# EAGLE design ESClogic (EAGLE 5.11)
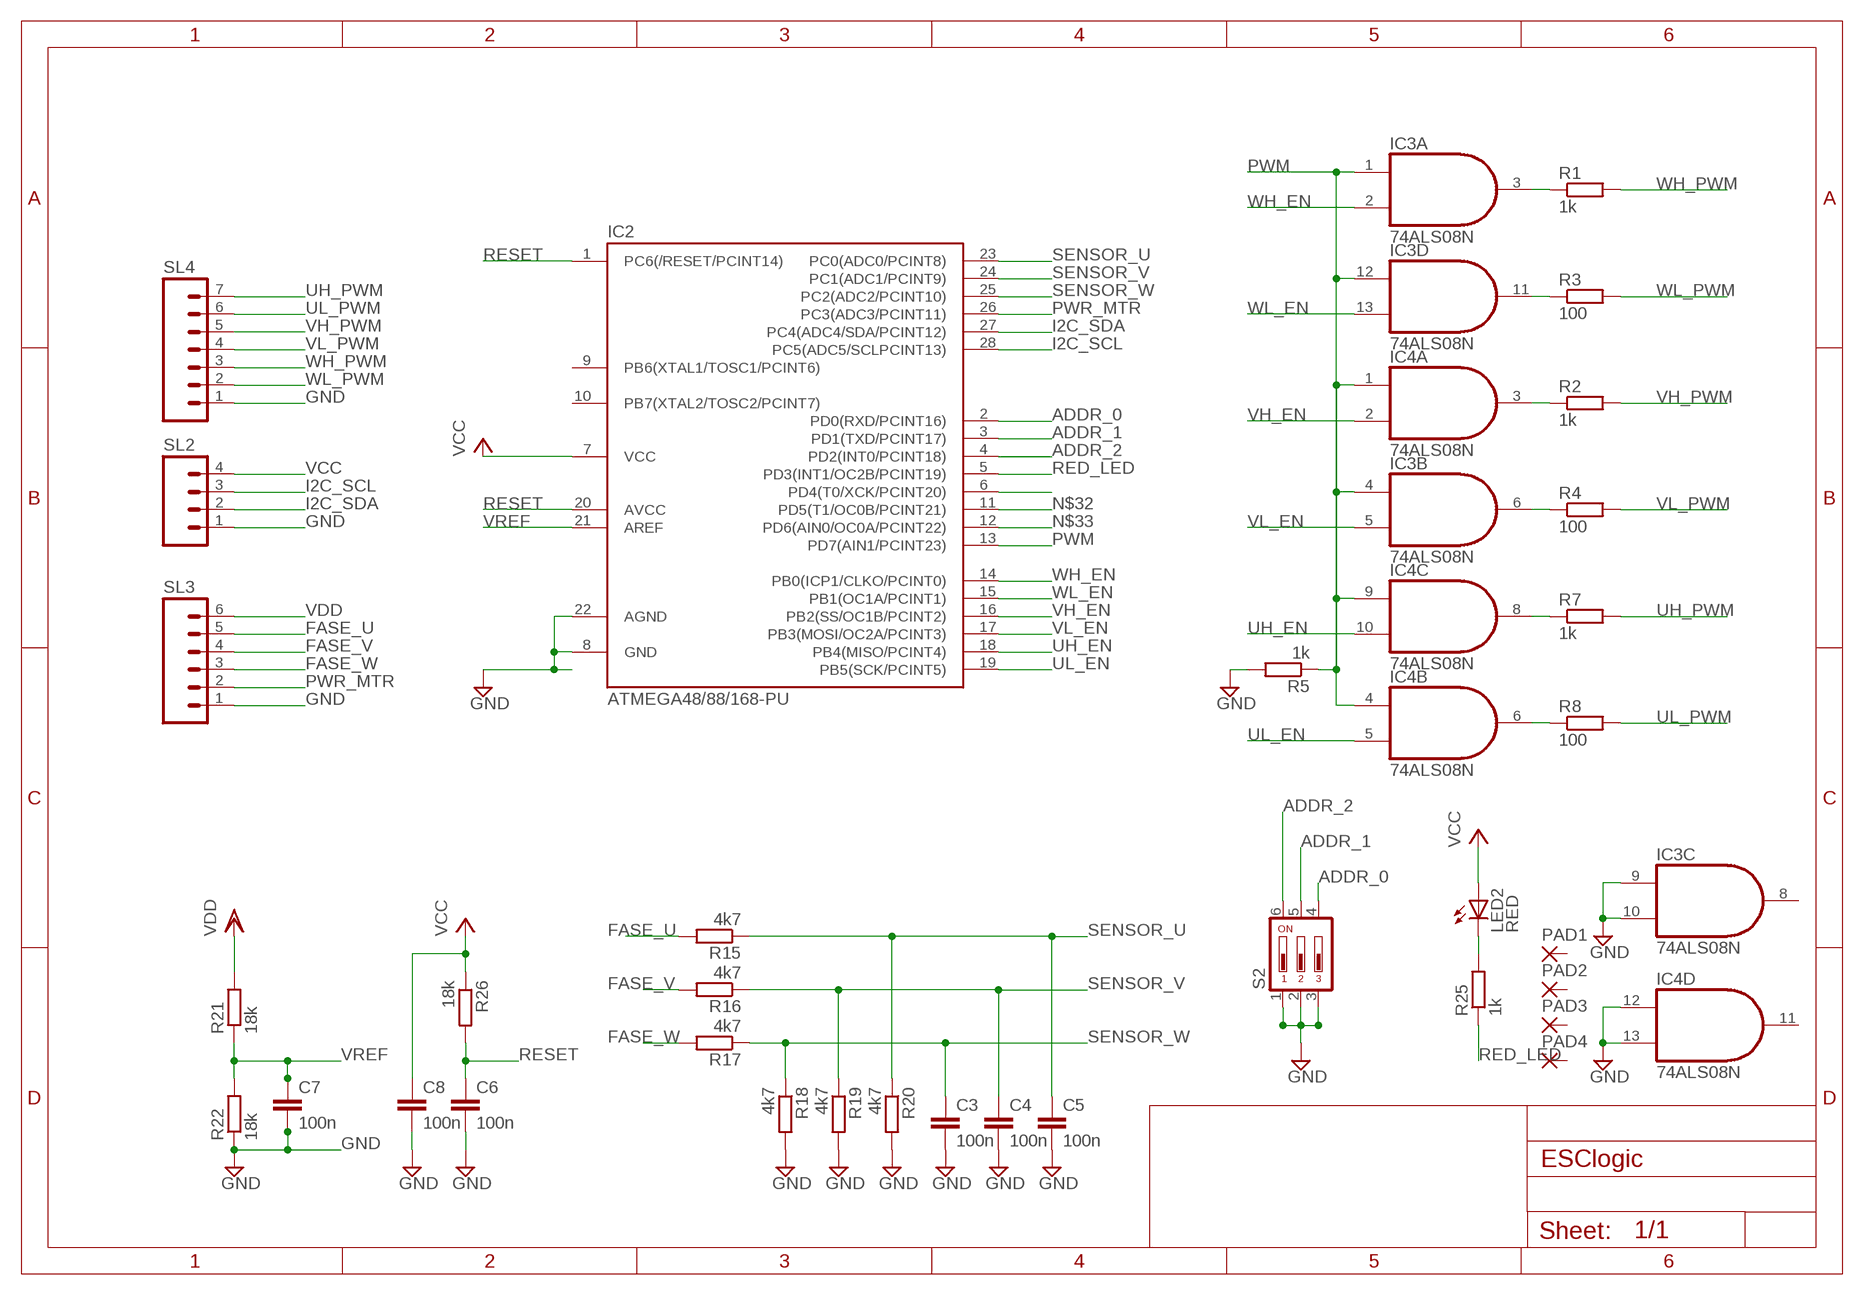
[diagram p0: schematic, sheet 1]

## Parts
C3  100n  C-EUC0805  [C0805]
C4  100n  C-EUC0805  [C0805]
C5  100n  C-EUC0805  [C0805]
C6  100n  C-EUC0805  [C0805]
C7  100n  C-EUC0805  [C0805]
C8  100n  C-EUC0805  [C0805]
IC2  ATMEGA48/88/168-PU  [DIL28-3]
IC3  74ALS08N  [DIL14]
IC4  74ALS08N  [DIL14]
LED2  RED  LEDLSU260  [LSU260]
PAD1  2,54/1,0  [2,54/1,0]
PAD2  2,54/1,0  [2,54/1,0]
PAD3  2,54/1,0  [2,54/1,0]
PAD4  2,54/1,0  [2,54/1,0]
R1  1k  R-EU_R0805  [R0805]
R2  1k  R-EU_M0805  [M0805]
R3  100  R-EU_M0805  [M0805]
R4  100  R-EU_M0805  [M0805]
R5  1k  R-EU_M0805  [M0805]
R7  1k  R-EU_M0805  [M0805]
R8  100  R-EU_M0805  [M0805]
R15  4k7  R-EU_M0805  [M0805]
R16  4k7  R-EU_M0805  [M0805]
R17  4k7  R-EU_M0805  [M0805]
R18  4k7  R-EU_M0805  [M0805]
R19  4k7  R-EU_M0805  [M0805]
R20  4k7  R-EU_M0805  [M0805]
R21  18k  R-EU_M0805  [M0805]
R22  18k  R-EU_M0805  [M0805]
R25  1k  R-EU_R0805  [R0805]
R26  18k  R-EU_M0805  [M0805]
S2  DIP03YL  [DIP03YL]
SL2  M04  [04P]
SL3  M06  [06P]
SL4  M07  [07P]

## Nets
ADDR_0: IC2.2(PD0(RXD/PCINT16)) S2.4
ADDR_1: IC2.3(PD1(TXD/PCINT17)) S2.5
ADDR_2: IC2.4(PD2(INT0/PCINT18)) S2.6
FASE_U: R15.2 SL3.5
FASE_V: R16.2 SL3.4
FASE_W: R17.2 SL3.3
GND: C3.2 C4.2 C5.2 C6.2 C7.2 C8.2 IC2.8(GND) IC2.22(AGND) IC3.9(C:I0) IC3.10(C:I1) IC4.12(D:I0) IC4.13(D:I1) R5.2 R18.2 R19.2 R20.2 R22.1 S2.1 S2.2 S2.3 SL2.1 SL3.1 SL4.1
I2C_SCL: IC2.28(PC5(ADC5/SCLPCINT13)) SL2.3
I2C_SDA: IC2.27(PC4(ADC4/SDA/PCINT12)) SL2.2
N$8: LED2.K(C) R25.2
N$12: IC3.3(A:O) R1.1
N$14: IC3.11(D:O) R3.1
N$15: IC4.3(A:O) R2.1
N$16: IC3.6(B:O) R4.1
N$17: IC4.8(C:O) R7.1
N$18: IC4.6(B:O) R8.1
N$31: IC2.6(PD4(T0/XCK/PCINT20))
N$32: IC2.11(PD5(T1/OC0B/PCINT21))
N$33: IC2.12(PD6(AIN0/OC0A/PCINT22))
PWM: IC2.13(PD7(AIN1/PCINT23)) IC3.1(A:I0) IC3.4(B:I0) IC3.12(D:I0) IC4.1(A:I0) IC4.4(B:I0) IC4.9(C:I0) R5.1
PWR_MTR: IC2.26(PC3(ADC3/PCINT11)) SL3.2
RED_LED: IC2.5(PD3(INT1/OC2B/PCINT19)) R25.1
RESET: C6.1 IC2.1(PC6(/RESET/PCINT14)) IC2.20(AVCC) R26.2
SENSOR_U: C5.1 IC2.23(PC0(ADC0/PCINT8)) R15.1 R20.1
SENSOR_V: C4.1 IC2.24(PC1(ADC1/PCINT9)) R16.1 R19.1
SENSOR_W: C3.1 IC2.25(PC2(ADC2/PCINT10)) R17.1 R18.1
UH_EN: IC2.18(PB4(MISO/PCINT4)) IC4.10(C:I1)
UH_PWM: R7.2 SL4.7
UL_EN: IC2.19(PB5(SCK/PCINT5)) IC4.5(B:I1)
UL_PWM: R8.2 SL4.6
VCC: C8.1 IC2.7(VCC) LED2.A R26.1 SL2.4
VDD: R21.2 SL3.6
VH_EN: IC2.16(PB2(SS/OC1B/PCINT2)) IC4.2(A:I1)
VH_PWM: R2.2 SL4.5
VL_EN: IC2.17(PB3(MOSI/OC2A/PCINT3)) IC3.5(B:I1)
VL_PWM: R4.2 SL4.4
VREF: C7.1 IC2.21(AREF) R21.1 R22.2
WH_EN: IC2.14(PB0(ICP1/CLKO/PCINT0)) IC3.2(A:I1)
WH_PWM: R1.2 SL4.3
WL_EN: IC2.15(PB1(OC1A/PCINT1)) IC3.13(D:I1)
WL_PWM: R3.2 SL4.2
Unconnected: IC2.9(PB6(XTAL1/TOSC1/PCINT6)) IC2.10(PB7(XTAL2/TOSC2/PCINT7)) IC3.8(C:O) IC4.11(D:O) PAD1.1(P) PAD2.1(P) PAD3.1(P) PAD4.1(P)

## Power pins joined to a net without a drawn wire
GND: IC3.7(P:GND) IC4.7(P:GND)
VCC: IC3.14(P:VCC) IC4.14(P:VCC)

## Library data of the parts
C3-C8 = rcl:C-EU: CAPACITOR, European symbol
IC2 = atmega8:ATMEGA48/88/168-PU
IC3 IC4 = 74xx-us:74*08: Quad 2-input AND gate
LED2 = led:LED: LED OSRAM: - CHIPLED LG R971, LG N971, LY N971, LG Q971, LY Q971, LO R971, LY R971 LH N974, LH R974 LS Q976, LO Q976, LY Q976 LO Q996 - Hyper CHIPLED LW Q18S LB Q993, LB Q99A, LB R99A - SideLED LS A670, LO A670, LY A670, LG A670, LP A670 LB A673, LV A673, LT A673, LW A673 LH A674 LY A675 LS A676, LA A676, LO A676, LY A676, LW A676 LS A679, LY A679, LG A679 - Hyper Micro SIDELED® LS Y876, LA Y876, LO Y876, LY Y876 LT Y87S - SmartLED LW L88C, LW L88S LB L89C, LB L89S, LG L890 LS L89K, LO L89K, LY L89K LS L896, LA L896, LO L896, LY L896 - TOPLED LS T670, LO T670, LY T670, LG T670, LP T670 LSG T670, LSP T670, LSY T670, LOP T670, LYG T670 LG T671, LOG T671, LSG T671 LB T673, LV T673, LT T673, LW T673 LH T674 LS T676, LA T676, LO T676, LY T676, LB T676, LH T676, LSB T676, LW T676 LB T67C, LV T67C, LT T67C, LS T67K, LO T67K, LY T67K, LW E67C LS E67B, LA E67B, LO E67B, LY E67B, LB E67C, LV E67C, LT E67C LW T67C LS T679, LY T679, LG T679 LS T770, LO T770, LY T770, LG T770, LP T770 LB T773, LV T773, LT T773, LW T773 LH T774 LS E675, LA E675, LY E675, LS T675 LS T776, LA T776, LO T776, LY T776, LB T776 LHGB T686 LT T68C, LB T68C - Hyper Mini TOPLED® LB M676 - Mini TOPLED Santana® LG M470 LS M47K, LO M47K, LY M47K Source: http://www.osram.convergy.de LUXEON: - LUMILED® LXK2-PW12-R00, LXK2-PW12-S00, LXK2-PW14-U00, LXK2-PW14-V00 LXK2-PM12-R00, LXK2-PM12-S00, LXK2-PM14-U00 LXK2-PE12-Q00, LXK2-PE12-R00, LXK2-PE12-S00, LXK2-PE14-T00, LXK2-PE14-U00 LXK2-PB12-K00, LXK2-PB12-L00, LXK2-PB12-M00, LXK2-PB14-N00, LXK2-PB14-P00, LXK2-PB14-Q00 LXK2-PR12-L00, LXK2-PR12-M00, LXK2-PR14-Q00, LXK2-PR14-R00 LXK2-PD12-Q00, LXK2-PD12-R00, LXK2-PD12-S00 LXK2-PH12-R00, LXK2-PH12-S00 LXK2-PL12-P00, LXK2-PL12-Q00, LXK2-PL12-R00 Source: www.luxeon.com KINGBRIGHT: KA-3528ASYC Source: www.kingbright.com
PAD1-PAD4 = wirepad:2,54/1,0: THROUGH-HOLE PAD
R1-R5 R7 R8 R15-R22 R25 = rcl:R-EU_: RESISTOR, European symbol
R26 = resistor:R-EU_: RESISTOR, European symbol
S2 = switch-dil:DIP03YL: DIL/CODE SWITCH; OC_FARNELL: unknown; OC_NEWARK: unknown
SL2 = con-amp-quick:M04: AMP QUICK CONNECTOR; OC_FARNELL: unknown; OC_NEWARK: unknown
SL3 = con-amp-quick:M06: AMP QUICK CONNECTOR; OC_FARNELL: unknown; OC_NEWARK: unknown
SL4 = con-amp-quick:M07: AMP QUICK CONNECTOR; OC_FARNELL: unknown; OC_NEWARK: unknown

## Board
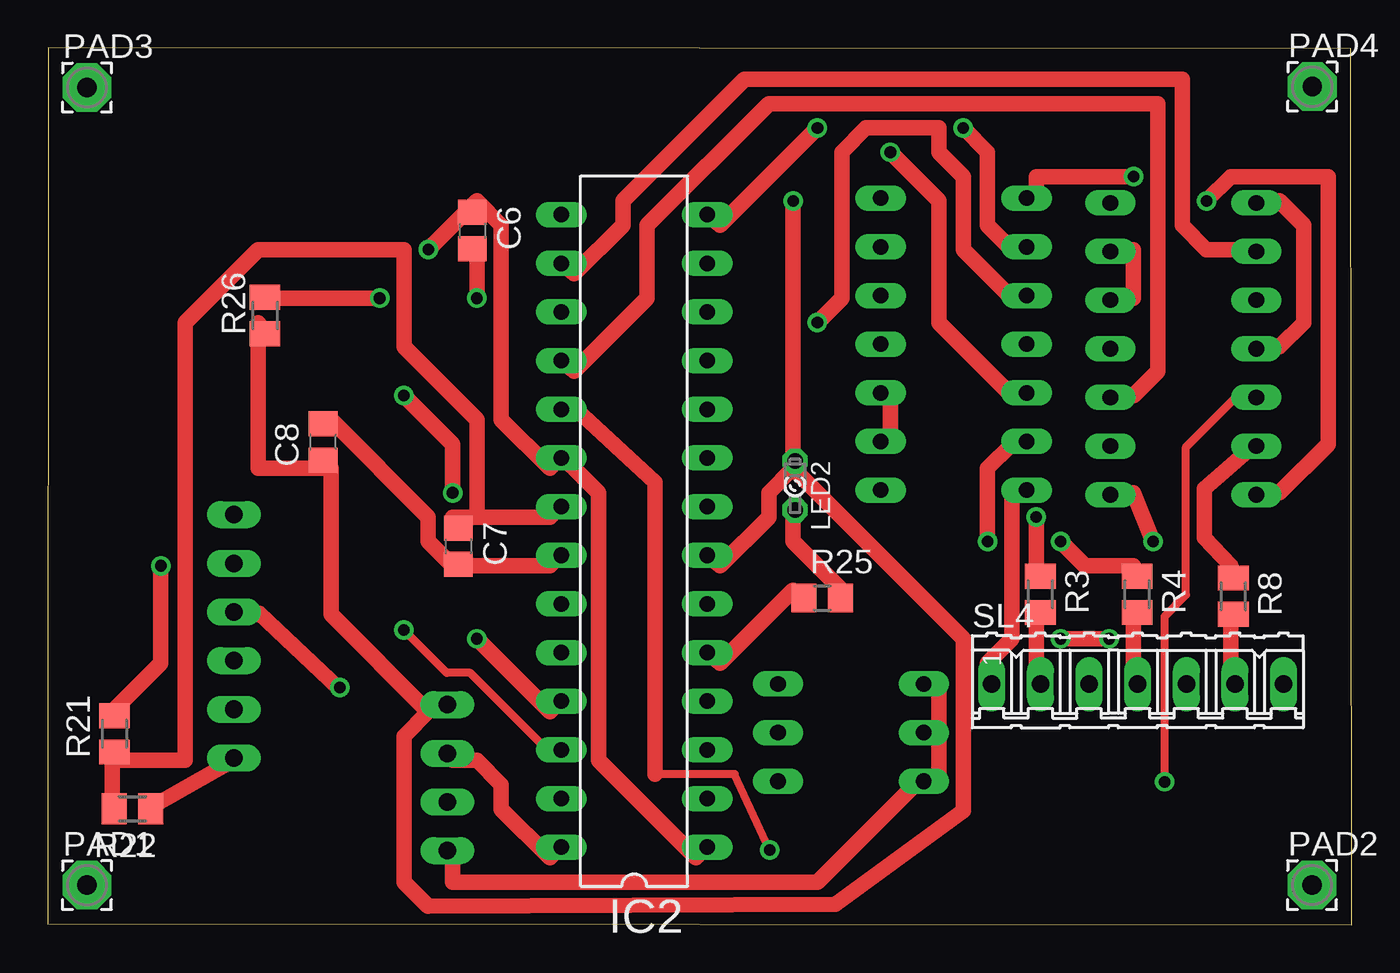
[diagram p1: board, top side]
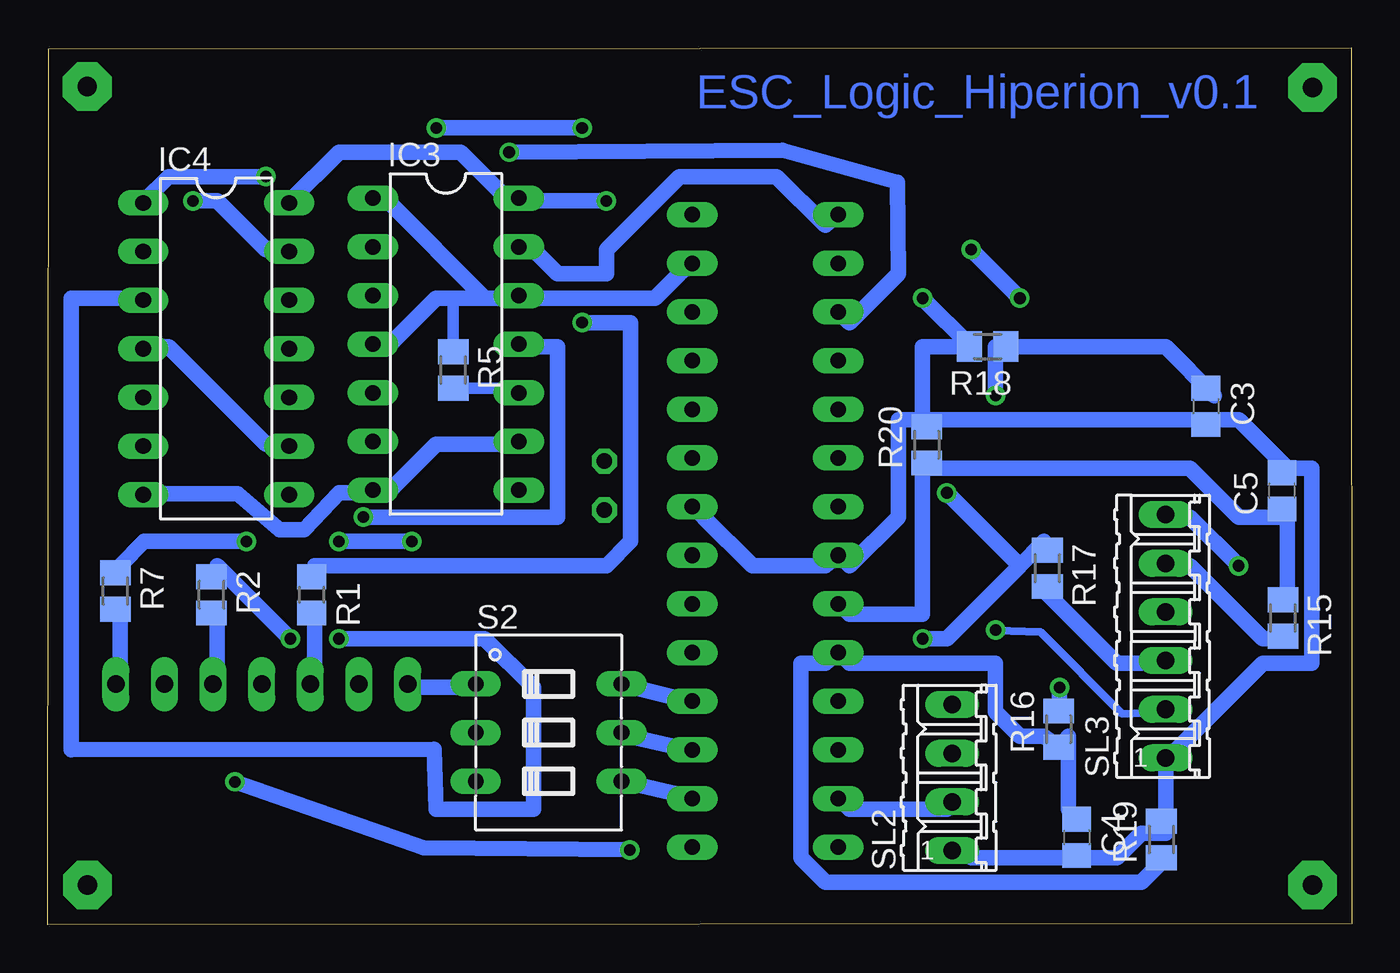
[diagram p2: board, bottom side, seen from below]

Size 68.09 x 45.79 mm. Coordinates in mm from the lower left corner, seen from the top.
Outline: 0,0.05 68.09,0 68.04,45.75 0.03,45.79 0,0.05
Copper layers (1*16): Top 0.035mm / dielectric 1.5mm / Bottom 0.035mm
Design rules "default *": minimum track width 0.8mm, minimum drill 24mil, track to track 8mil, track to pad 8mil, pad to pad 8mil, via to via 8mil, smd to smd 8mil, copper to edge 40mil, drill to drill 8mil, minimum pad ring 10mil, minimum via ring 8mil, stop-mask expansion 4mil, vias tented up to drill 0mil, thermal gap 10mil

### Footprints (pad centres in the part's own frame; a part is rotated, then mirrored left to right if it is on the bottom)
C0805 = smd 1.3 x 1.5: 1 -0.95,0; 2 0.95,0
DIL28-3 = drill 0.813 long: 1 -16.51,-3.81; 2 -13.97,-3.81; 3 -11.43,-3.81; 4 -8.89,-3.81; 5 -6.35,-3.81; 6 -3.81,-3.81; 7 -1.27,-3.81; 8 1.27,-3.81; 9 3.81,-3.81; 10 6.35,-3.81; 11 8.89,-3.81; 12 11.43,-3.81; 13 13.97,-3.81; 14 16.51,-3.81; 15 16.51,3.81; 16 13.97,3.81; 17 11.43,3.81; 18 8.89,3.81; 19 6.35,3.81; 20 3.81,3.81; 21 1.27,3.81; 22 -1.27,3.81; 23 -3.81,3.81; 24 -6.35,3.81; 25 -8.89,3.81; 26 -11.43,3.81; 27 -13.97,3.81; 28 -16.51,3.81
DIL14 = drill 0.813 long: 1 -7.62,-3.81; 2 -5.08,-3.81; 3 -2.54,-3.81; 4 0,-3.81; 5 2.54,-3.81; 6 5.08,-3.81; 7 7.62,-3.81; 8 7.62,3.81; 9 5.08,3.81; 10 2.54,3.81; 11 0,3.81; 12 -2.54,3.81; 13 -5.08,3.81; 14 -7.62,3.81
LSU260 = drill 0.813 octagon: A -1.27,0; K 1.27,0
2,54/1,0 = drill 1.016 pad 2.54 octagon: 1 0,0
R0805 = smd 1.3 x 1.5: 1 -0.95,0; 2 0.95,0
M0805 = smd 1.3 x 1.6: 1 -0.95,0; 2 0.95,0
DIP03YL = drill 0.813 long: 1 -2.54,-3.81; 2 0,-3.81; 3 2.54,-3.81; 4 2.54,3.81; 5 0,3.81; 6 -2.54,3.81
04P = drill 0.914 long: 1 -3.81,0; 2 -1.27,0; 3 1.27,0; 4 3.81,0
06P = drill 0.914 long: 1 -6.35,0; 2 -3.81,0; 3 -1.27,0; 4 1.27,0; 5 3.81,0; 6 6.35,0
07P = drill 0.914 long: 1 -7.62,0; 2 -5.08,0; 3 -2.54,0; 4 0,0; 5 2.54,0; 6 5.08,0; 7 7.62,0

### Placement (x,y rotation side)
C3  7.61,27.07 270 bottom
C4  14.36,4.57 270 bottom
C5  3.63,22.66 90 bottom
C6  22.17,36.25 270 top
C7  21.44,19.77 270 top
C8  14.38,25.21 90 top
IC2  30.62,20.57 90 top
IC3  47.3,30.32 270 bottom
IC4  59.3,30.08 270 bottom
LED2  39.02,22.94 270 top
PAD1  2.04,2.08 0 top
PAD2  66.02,2.08 0 top
PAD3  2.05,43.72 0 top
PAD4  66.04,43.76 0 top
R1  54.32,17.23 270 bottom
R2  59.54,17.23 270 bottom
R3  51.84,17.26 270 top
R4  56.89,17.26 270 top
R5  46.92,28.97 270 bottom
R7  64.56,17.43 270 bottom
R8  61.91,17.16 270 top
R15  3.59,16.02 270 bottom
R16  15.3,10.22 90 bottom
R17  15.89,18.62 270 bottom
R18  19.02,30.2 180 bottom
R19  9.94,4.46 90 bottom
R20  22.19,25.06 90 bottom
R21  3.48,9.98 90 top
R22  4.42,6.06 180 top
R25  40.44,17.07 0 top
R26  11.34,31.81 90 top
S2  41.94,10.04 270 bottom
SL2  20.86,7.69 90 bottom
SL3  9.72,15.07 90 bottom
SL4  56.92,12.57 0 top

### Tracks (layer width: path | path; a pad name or v marks a point on that pad's centre or on a via)
ADDR_0
  Bottom 0.8: IC2.2 34.5,6.66 38.21,7.52 38.16,7.52 S2.4
ADDR_1
  Bottom 0.8: IC2.3 34.4,9.1 38.21,9.96 37.65,9.86 S2.5
ADDR_2
  Bottom 0.8: IC2.4 34.4,11.64 38.21,12.6 37.65,12.4 S2.6
FASE_U
  Bottom 0.8: R15.2 3.36,14.94 4.63,14.94 8.44,18.75 9.71,18.75 SL3.5
FASE_V  (via drill 0.61)
  Top 0.8: v15.25,12.4 15.2,12.35 11.03,16.26 10.98,16.21 SL3.4
  Bottom 0.8: v15.25,12.4 15.3,11.13 R16.2
FASE_W
  Bottom 0.8: R17.2 16.06,17.48 12.25,13.67 10.98,13.67 SL3.3
GND  (via drill 0.61)
  Top 0.8: 46.54,9.86 46.54,7.32 S2.3 45.27,7.32 40.19,2.24 21.14,2.24 21.14,3.51 SL2.1 | 46.54,9.86 46.54,12.4 S2.1 | 46.54,9.86 S2.2 | IC4.12 56.7,32.72 56.7,35.26 IC4.13 | IC3.9 44,25.1 44,27.64 IC3.10 | v60.51,37.8 61.78,39.07 66.86,39.07 66.86,25.1 64.32,22.56 IC4.7 | SL4.1 49.08,13.67 50.35,14.94 50.35,22.56 IC3.7 | 21.14,18.75 26.22,18.75 IC2.22 | 21.14,18.75 19.87,20.02 19.87,21.29 14.79,26.37 C8.2 | 21.14,18.75 C7.2 | R22.1 5.42,6.18 9.71,8.59 SL3.1 | v22.41,32.72 22.41,35.26 C6.2
  Bottom 0.61: R5.2 43.8,28.02 43.8,27.69 43.52,27.69 | 43.52,27.69 43.32,27.69 43.32,27.77 | IC3.10 43.52,27.78 43.52,27.69
  Bottom 0.8: SL4.1 49.08,12.4 46.54,12.4 S2.1 | IC3.9 44,25.1 47.81,25.1 50.35,22.56 IC3.7 51.62,22.56 52.89,22.56 54.72,20.63 55.99,20.63 58.17,22.51 61.98,22.51 63.05,22.56 IC4.7 | v60.51,37.8 59.24,37.8 56.7,35.26 IC4.13 | IC2.8 33.84,21.29 31.3,18.75 27.49,18.75 IC2.22 26.22,18.75 23.68,21.29 23.68,26.37 22.41,26.37 | 14.79,3.51 19.87,3.51 SL2.1 | 9.71,8.59 9.71,6.05 R19.2 9.71,4.78 10.98,4.78 12.25,3.51 14.79,3.51 | 14.79,3.51 C4.2 | 3.36,23.83 5.9,26.37 7.17,26.37 | 19.87,30.18 v22.41,32.72 | 22.41,26.37 22.41,30.18 19.87,30.18 | 19.87,30.18 R18.2 | 7.17,26.37 22.41,26.37 | 7.17,26.37 C3.2 | 9.71,8.59 4.63,13.67 2.09,13.67 2.09,23.83 3.36,23.83 | SL3.1 9.71,8.59 | 3.36,23.83 C5.2 | 22.41,26.37 R20.2
I2C_SCL
  Top 0.8: IC2.28 26.22,3.51 23.68,6.05 23.68,7.32 22.41,8.59 21.14,8.59 SL2.3
I2C_SDA
  Bottom 0.8: IC2.27 26.22,6.05 21.14,6.05 SL2.2
N$8
  Top 0.8: R25.2 41.46,17.48 38.92,20.02 38.92,21.29 LED2.K
N$12  (via drill 0.61)
  Top 0.8: v40.19,31.45 41.46,32.72 41.46,40.34 42.73,41.61 46.54,41.61 46.54,40.34 47.81,39.07 47.81,35.26 50.35,32.72 IC3.3
  Bottom 0.8: v40.19,31.45 37.65,31.45 37.65,20.02 38.92,18.75 54.16,18.75 R1.1
N$14  (via drill 0.61)
  Top 0.8: v51.62,21.29 51.62,18.75 R3.1
  Bottom 0.8: v51.62,21.29 41.46,21.29 41.46,30.18 42.73,30.18 IC3.11
N$15  (via drill 0.61)
  Top 0.8: v52.89,14.94 v55.43,14.94
  Bottom 0.8: v55.43,14.94 59.24,18.75 R2.1 | v52.89,14.94 45.27,14.94 42.73,12.4 42.73,6.05 47.82,6.05 47.92,9.17 66.88,9.15 66.86,11.13 66.86,32.72 64.32,32.72 IC4.3
N$16  (via drill 0.61)
  Top 0.8: v52.89,20.02 54.16,18.75 56.7,18.75 R4.1 | v49.08,20.02 49.08,23.83 50.35,25.1 IC3.6
  Bottom 0.8: v49.08,20.02 v52.89,20.02
N$17  (via drill 0.61)
  Top 0.8: v57.72,20.02 56.7,22.56 IC4.8
  Bottom 0.8: v57.72,20.02 63.05,20.02 64.32,18.75 R7.1
N$18
  Top 0.8: R8.1 61.78,18.75 60.41,20.22 60.41,22.76 63.05,25.1 IC4.6
PWM  (via drill 0.61)
  Top 0.8: IC4.1 64.32,37.8 65.59,36.53 65.59,31.45 64.32,30.18 IC4.4 | v56.7,39.07 51.62,39.07 51.62,37.8 IC3.1
  Bottom 0.61: 47.81,32.72 46.92,32.72 46.92,30.07 47.02,30.07 47.02,29.67 46.92,29.67 R5.1
  Bottom 0.8: IC4.9 56.7,25.1 61.78,30.18 63.05,30.18 IC4.4 | IC2.13 35.11,33.99 36.38,32.72 42.73,32.72 IC3.12 44,32.72 45.27,32.72 | 45.27,32.72 47.81,32.72 50.35,30.18 IC3.4 | 45.27,32.72 50.35,37.8 IC3.1 | v56.7,39.07 61.78,39.07 63.05,37.8 IC4.1
PWR_MTR  (via drill 0.6)
  Top 0.406: IC2.26 26.07,9.14 22.05,13.16 20.83,13.16 v18.6,15.39
  Bottom 0.406: v18.6,15.39 16.26,15.29 11.99,11.03 9.66,11.13 9.55,11.23 9.76,11.23 9.96,11.03 9.96,11.13 9.66,11.43 9.66,11.32 SL3.2
RED_LED
  Top 0.8: R25.1 38.92,17.48 35.11,13.67 IC2.5
RESET  (via drill 0.61)
  Top 0.8: 22.41,37.8 23.68,36.53 23.68,26.37 26.22,23.83 IC2.20 27.49,23.83 28.76,22.56 28.76,8.59 33.84,3.51 IC2.1 | v17.33,32.72 10.98,32.72 R26.2 | 22.41,37.8 v19.87,35.26 | 22.41,37.8 C6.1
  Bottom 0.8: v19.87,35.26 v17.33,32.72
SENSOR_U
  Bottom 0.8: 3.36,21.29 3.36,17.48 R15.1 | 22.41,23.83 22.41,16.21 26.22,16.21 IC2.23 | 3.36,21.29 5.9,21.29 8.44,23.83 22.41,23.83 | 3.36,21.29 C5.1 | 22.41,23.83 R20.1
SENSOR_V
  Bottom 0.8: C4.1 14.79,6.05 14.79,9.86 R16.1 16.06,9.86 17.33,9.86 18.6,11.13 18.6,13.67 26.22,13.67 IC2.24 27.49,13.67 28.76,13.67 28.76,3.51 27.49,2.24 10.98,2.24 9.71,3.51 R19.1
SENSOR_W  (via drill 0.61)
  Top 0.8: v22.41,14.94 26.22,11.13 IC2.25 | v18.6,27.64 21.14,25.1 v21.14,22.56
  Bottom 0.8: 18.6,30.18 9.71,30.18 7.17,27.64 C3.1 | 17.33,18.75 21.14,14.94 v22.41,14.94 | 17.33,18.75 16.06,20.02 R17.1 | 18.6,30.18 v18.6,27.64 | v21.14,22.56 17.33,18.75 | 18.6,30.18 R18.1
UH_EN
  Top 0.8: IC2.18 27.49,28.91 31.3,32.72 31.3,36.53 37.65,42.88 57.97,42.88 57.97,28.91 56.7,27.64 IC4.10
UH_PWM
  Bottom 0.8: R7.2 64.32,16.21 64.32,13.67 SL4.7
UL_EN  (via drill 0.6)
  Top 0.406: 31.7,7.88 35.87,7.88 v37.7,3.91 | v58.32,7.47 58.32,16.11 59.44,17.22 59.44,24.94 61.98,27.48 63.06,27.48 IC4.5
  Top 0.813: IC2.19 27.6,26.92 31.7,23.12 31.7,7.88
  Bottom 0.813: v37.7,3.91 48.47,4.01 v58.32,7.47
UL_PWM
  Top 0.8: R8.2 61.78,16.21 61.78,13.67 SL4.6
VCC  (via drill 0.61)
  Top 0.8: 14.79,23.83 10.98,23.83 10.98,31.45 R26.1 | 19.87,11.13 14.79,16.21 14.79,23.83 | 14.79,23.83 C8.1 | 38.92,23.83 37.65,22.56 37.65,21.29 35.11,18.75 IC2.7 | 38.92,23.83 v38.92,37.8 | 19.87,11.13 18.6,9.86 18.6,2.24 19.87,0.97 41.12,1.07 47.82,5.97 47.81,14.94 38.92,23.83 | 19.87,11.13 SL2.4 | 38.92,23.83 LED2.A
  Bottom 0.8: IC4.14 55.43,37.8 52.89,40.34 46.54,40.34 44,37.8 IC3.14 42.73,37.8 v38.92,37.8
VDD  (via drill 0.61)
  Top 0.8: v5.9,18.75 5.9,13.67 3.36,11.13 R21.2
  Bottom 0.8: v5.9,18.75 8.44,21.29 9.71,21.29 SL3.6
VH_EN
  Top 0.8: IC2.16 27.49,33.99 30.03,36.53 30.03,37.8 36.38,44.15 59.24,44.15 59.24,36.53 60.51,35.26 63.05,35.26 IC4.2
VH_PWM
  Bottom 0.8: R2.2 59.24,16.21 59.24,13.67 SL4.5
VL_EN  (via drill 0.61)
  Top 0.8: v44,40.34 46.54,37.8 46.54,31.45 50.35,27.64 IC3.5
  Bottom 0.8: v44,40.34 29.72,40.44 23.72,38.77 23.68,33.99 26.22,31.45 IC2.17
VL_PWM
  Top 0.8: R4.2 56.7,16.21 56.7,13.67 SL4.4
VREF
  Top 0.8: 3.36,8.59 3.36,5.79 R22.2 | 22.41,21.29 26.22,21.29 IC2.21 | 22.41,21.29 21.14,21.29 C7.1 | 3.36,8.59 7.17,8.59 7.17,31.45 10.98,35.26 18.6,35.26 18.6,30.18 22.41,26.37 22.41,21.29 | 3.36,8.59 R21.1
WH_EN  (via drill 0.61)
  Top 0.8: v40.19,41.61 35.11,36.53 IC2.14 | v47.81,41.61 49.08,40.34 49.08,36.53 50.35,35.26 IC3.2
  Bottom 0.8: v40.19,41.61 v47.81,41.61
WH_PWM
  Bottom 0.8: R1.2 54.16,16.21 54.16,13.67 SL4.3
WL_EN
  Bottom 0.8: IC2.15 27.49,36.53 30.03,39.07 35.11,39.07 38.92,35.26 38.92,33.99 41.46,33.99 42.73,35.26 IC3.13
WL_PWM
  Top 0.8: R3.2 51.62,16.21 51.62,13.67 SL4.2

### Text on the board
Bottom: ESC_Logic_Hiperion_v0.1